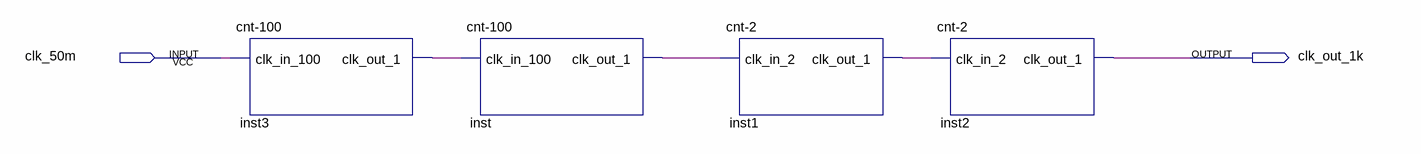
[diagram p0: schematic sheet]
// Quartus schematic clk_1k.bdf as structural Verilog: 4 symbols, 2 pins
module clk_1k (
  input  clk_50m,
  output clk_out_1k
);

  wire inst1_clk_out_1, inst3_clk_out_1, inst_clk_out_1;

  \cnt-100  inst3 (.clk_in_100(clk_50m), .clk_out_1(inst3_clk_out_1));
  \cnt-100  inst (.clk_in_100(inst3_clk_out_1), .clk_out_1(inst_clk_out_1));
  \cnt-2  inst1 (.clk_in_2(inst_clk_out_1), .clk_out_1(inst1_clk_out_1));
  \cnt-2  inst2 (.clk_in_2(inst1_clk_out_1), .clk_out_1(clk_out_1k));
endmodule
